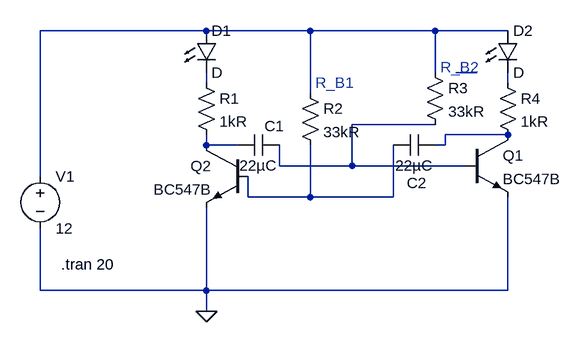
[diagram p0: schematic astable_multivibrator.asc]
astable_multivibrator.asc, the LTspice schematic file:
Version 4
SHEET 1 880 680
WIRE 272 -96 16 -96
WIRE 432 -96 272 -96
WIRE 624 -96 432 -96
WIRE 736 -96 624 -96
WIRE 624 -32 624 -96
WIRE 688 -32 656 -32
WIRE 272 -16 272 -32
WIRE 736 -16 736 -32
WIRE 432 0 432 -96
WIRE 624 48 496 48
WIRE 736 64 640 64
WIRE 272 80 272 64
WIRE 320 80 272 80
WIRE 640 80 640 64
WIRE 640 80 624 80
WIRE 384 112 384 80
WIRE 496 112 496 48
WIRE 496 112 384 112
WIRE 672 112 496 112
WIRE 16 128 16 -96
WIRE 336 160 336 128
WIRE 432 160 432 80
WIRE 432 160 336 160
WIRE 560 160 560 80
WIRE 560 160 432 160
WIRE 16 304 16 208
WIRE 272 304 272 176
WIRE 272 304 16 304
WIRE 736 304 736 160
WIRE 736 304 272 304
WIRE 272 336 272 304
FLAG 272 336 0
SYMBOL voltage 16 112 R0
WINDOW 123 0 0 Left 0
WINDOW 39 0 0 Left 0
SYMATTR InstName V1
SYMATTR Value 12
SYMBOL res 256 -32 R0
SYMATTR InstName R1
SYMATTR Value 1kR
SYMBOL res 416 -16 R0
SYMATTR InstName R2
SYMATTR Value 33kR
SYMBOL res 608 -48 R0
SYMATTR InstName R3
SYMATTR Value 33kR
SYMBOL res 720 -32 R0
SYMATTR InstName R4
SYMATTR Value 1kR
SYMBOL cap 384 64 R90
WINDOW 0 2 7 VBottom 2
WINDOW 3 32 32 VTop 2
SYMATTR InstName C1
SYMATTR Value 22µC
SYMBOL cap 624 64 R90
WINDOW 0 90 28 VBottom 2
WINDOW 3 32 32 VTop 2
SYMATTR InstName C2
SYMATTR Value 22µC
SYMBOL npn 672 64 R0
SYMATTR InstName Q1
SYMATTR Value BC547B
SYMBOL npn 336 80 M0
SYMATTR InstName Q2
SYMATTR Value BC547B
SYMBOL LED 256 -96 R0
SYMATTR InstName D1
SYMBOL LED 720 -96 R0
SYMATTR InstName D2
TEXT 48 264 Left 2 !.tran 20
TEXT 440 -16 Left 2 ;R_B1
TEXT 632 -40 Left 2 ;R_B2

The netlist it stands for:
* astable_multivibrator.asc
V1 N001 0 12
R1 N003 N007 1kR
R2 N001 N008 33kR
R3 N001 N005 33kR
R4 N004 N006 1kR
C1 N005 N007 22µC
C2 N006 N008 22µC
Q1 N006 N005 0 0 BC547B
Q2 N007 N008 0 0 BC547B
D1 N001 N003 D
D2 N001 N004 D
.model D D
.lib standard.dio
.model NPN NPN
.model PNP PNP
.lib standard.bjt
.tran 20
* R_B1
* R_B2
.backanno
.end